# Altium schematic sheet i2c-can-lin.SchDoc: CAN and I2C
size A4; Organization: Institut d'Automatisation Industrielle; SVN: OUI; ProjectName: <projet>
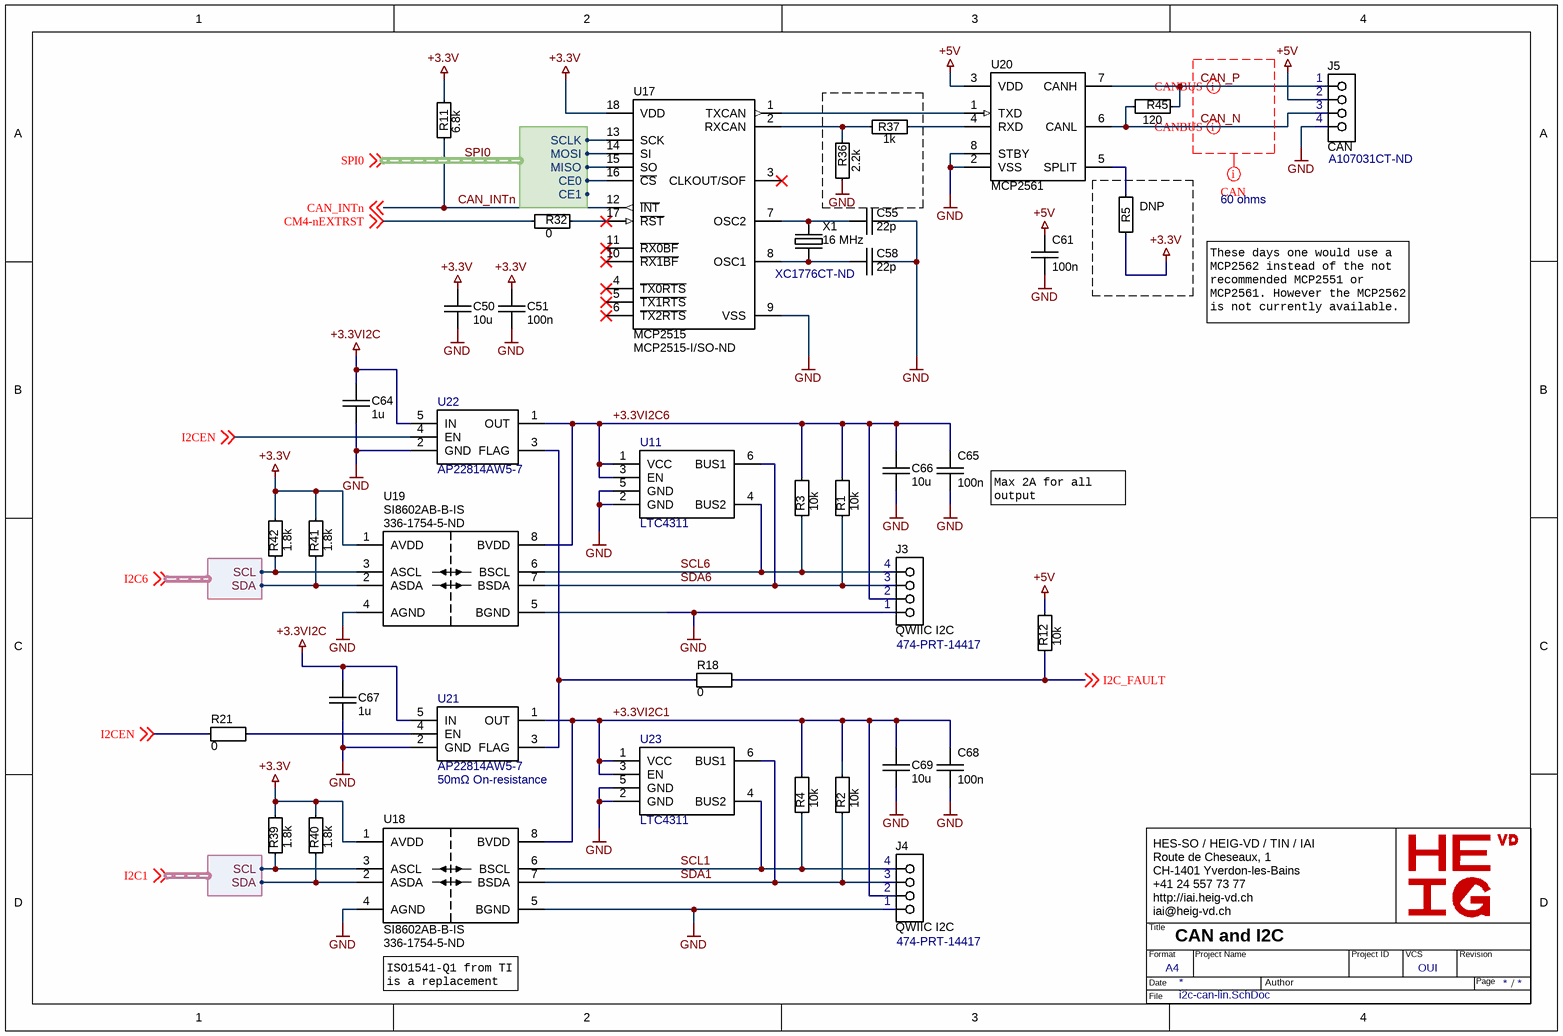
[diagram p0: i2c-can-lin.SchDoc]

## Parts
C50  10u  [SM/C0805]
C51  100n  [SM/C0603]
C55  22p  [SM/C0603]
C58  22p  [SM/C0603]
C61  100n  [SM/C0603]
C64  1u  [SM/C0603]
C65  100n  [SM/C0603]
C66  10u  [SM/C0805]
C67  1u  [SM/C0603]
C68  100n  [SM/C0603]
C69  10u  [SM/C0805]
J3  QWIIC I2C  Supplier Part Number 1: 474-PRT-14417  [QWIIC-SM04B-SRSS-TB]
J4  QWIIC I2C  Supplier Part Number 1: 474-PRT-14417  [QWIIC-SM04B-SRSS-TB]
J5  CAN  Supplier Part Number 1: A107031CT-ND  [TE/MICROMATCH/7-2178711-4]
R1  10k  [SM/R0603]
R2  10k  [SM/R0603]
R3  10k  [SM/R0603]
R4  10k  [SM/R0603]
R5  DNP  [SM/R0805]
R11  6.8k  [SM/R0805]
R12  10k  [SM/R0603]
R18  0  [SM/R0603]
R21  0  [SM/R0603]
R32  0  [SM/R0805]  (net tie)
R36  2.2k  [SM/R0805]
R37  1k  [SM/R0805]
R39  1.8k  [SM/R0603]
R40  1.8k  [SM/R0603]
R41  1.8k  [SM/R0603]
R42  1.8k  [SM/R0603]
R45  120  [SM/R0805]
U11  LTC4311  [SC70-6]
U17  MCP2515  Supplier Part Number 1: MCP2515-I/SO-ND  [SOIC18/MCP2515]
U18  SI8602AB-B-IS  Supplier Part Number 1: 336-1754-5-ND  [SOIC8]
U19  SI8602AB-B-IS  Supplier Part Number 1: 336-1754-5-ND  [SOIC8]
U20  MCP2561  [SOIC8]
U21  AP22814AW5-7  [SOT23-5]
U22  AP22814AW5-7  [SOT23-5]
U23  LTC4311  [SC70-6]
X1  16 MHz  Supplier Part Number 1: XC1776CT-ND  [XTAL-ECS-160-20-3X-TR]

## Harnesses
I2C: SDA, SCL
SPI: CE0, MISO, MOSI, SCLK, CE1

## Nets
+3.3V: C50.1 C51.1 R5.1 R11.2 R39.1 R40.1 R41.1 R42.1 U17.18(VDD) U18.1(AVDD) U19.1(AVDD)
+3.3VI2C: C64.1 C67.1 U21.5(IN) U22.5(IN)
+5V: C61.1 J5.2 R12.1 U20.3(VDD)
GND: C50.2 C51.2 C55.2 C58.2 C61.2 C64.2 C65.2 C66.2 C67.2 C68.2 C69.2 J3.1 J4.1 J5.4 R36.1 U11.2(GND) U11.5(GND) U17.9(VSS) U18.4(AGND) U18.5(BGND) U19.4(AGND) U19.5(BGND) U20.2(VSS) U20.8(STBY) U21.2(GND) U22.2(GND) U23.2(GND) U23.5(GND)
+3.3VI2C1: C68.1 C69.1 J4.2 R2.1 R4.1 U18.8(BVDD) U21.1(OUT) U23.1(VCC) U23.3(EN)
+3.3VI2C6: C65.1 C66.1 J3.2 R1.1 R3.1 U11.1(VCC) U11.3(EN) U19.8(BVDD) U22.1(OUT)
CAN_INTn: R11.1 U17.12(~{INT}) ; off-sheet CAN_INTn
CAN_N: J5.3 R45.1 U20.6(CANL)
CAN_P: J5.1 R45.2 U20.7(CANH)
CM4-nEXTRST: R32.2 ; off-sheet CM4-nEXTRST
I2C_FAULT: R12.2 R18.2 ; off-sheet I2C_FAULT
I2CEN: R21.1 U22.4(EN) ; off-sheet I2CEN
SCL1: J4.4 R4.2 U18.6(BSCL) U23.4(BUS2)
SCL6: J3.4 R3.2 U11.4(BUS2) U19.6(BSCL)
SDA1: J4.3 R2.2 U18.7(BSDA) U23.6(BUS1)
SDA6: J3.3 R1.2 U11.6(BUS1) U19.7(BSDA)
SPI0.CE0: U17.16(~{CS}) ; harness SPI.CE0
SPI0.MISO: U17.15(SO) ; harness SPI.MISO
SPI0.MOSI: U17.14(SI) ; harness SPI.MOSI
SPI0.SCLK: U17.13(SCK) ; harness SPI.SCLK
NetC55_1: C55.1 U17.7(OSC2) X1.2
NetC58_1: C58.1 U17.8(OSC1) X1.1
NetR5_2: R5.2 U20.5(SPLIT)
NetR18_1: R18.1 U21.3(FLAG) U22.3(FLAG)
NetR21_2: R21.2 U21.4(EN)
NetR32_1: R32.1 U17.17(~{RST})
NetR36_2: R36.2 R37.1 U17.2(RXCAN)
NetR37_2: R37.2 U20.4(RXD)
NetR39_2: R39.2 U18.3(ASCL) ; harness I2C.SCL
NetR40_2: R40.2 U18.2(ASDA) ; harness I2C.SDA
NetR41_2: R41.2 U19.2(ASDA) ; harness I2C.SDA
NetR42_2: R42.2 U19.3(ASCL) ; harness I2C.SCL
NetU17_1: U17.1(TXCAN) U20.1(TXD)

Not connected (* = marked no-connect by the designer): U17 3(CLKOUT/SOF)* 4(~{TX0RTS})* 5(~{TX1RTS})* 6(~{TX2RTS})* 10(~{RX1BF})* 11(~{RX0BF})*

## Layout directives
differential pair: CAN_N, CAN_P
rule Impedance Constraint [Min = 50.00    Max = 70.00    ]; Impedance: 60 ohms: CAN_N, CAN_P

## Notes on the sheet
- These days one would use a MCP2562 instead of the not recommended MCP2551 or MCP2561. However the MCP2562 is not currently available.
- (near C65) Max 2A for all output
- (near U21) 50mΩ On-resistance
- (near U18) ISO1541-Q1 from TI is a replacement for the SI8602AB
- Labels drawn without touching a wire or pin: I2C1, I2C6, SPI0
- HES-SO / HEIG-VD / TIN / IAI
  Route de Cheseaux, 1
  CH-1401 Yverdon-les-Bains
  +41 24 557 73 77
  http://iai.heig-vd.ch
  iai@heig-vd.ch
- Title
- Format
- Date
- A4
- Project Name
- Author
- Project ID
- VCS
- Revision
- Page
- /
- File

## Library data of the parts
C50 C55 C58 C66 C69 = C: Chip Capacitor
C51 C61 C64 C65 C67 C68 = C: Chip Capacitor; Voltage: 16V; Dielectric: X7R; Supplier 2 Part Number: 1292-1393-1-ND; Supplier 2: Digi-Key
J3-J5 = CONN 4
  J3 J4: Supplier 1: Mouser
  J5: Supplier 1: Digi-Key
R1-R5 R11 R12 R18 R21 R32 R36 R37 R39-R42 R45 = R: Chip Resistor SMD
U11 U23 = LTC4311: The LTC®4311 is a dual I2C active pull-up designed to / enhance data transmission speed and reliability for bus / loading conditions well beyond the 400pF I2C specifi cation / limit. The LTC4311 operates at supply voltages from 1.6V / to 5.5V and is also compatible with SMBus.
U18 U19 = SI8602AB-B-IS: Low-power dual channel digital isolator; Supplier 1: Digi-Key
U21 U22 = AP22804: Supplier 1: Digi-Key; Supplier Part Number 1: AP22814AW5-7DICT-ND
X1 = XTAL: Supplier 1: Digi-Key
U17 = MCP2515: Supplier 1: Digi-Key